# Altium schematic sheet Analog.SchDoc: Analog Input Filter and Protection
size Letter; Revision: 1.0; SheetNumber: 5; PageSetup: Record=PageOptions|CenterHorizontal=True|CenterVertical=True|PrintScale=1.00|XCorrection=1.00|YCorrection=1.00|PrintKind=1|BorderSize=5000000|LeftOffset=0|BottomOffset=0|Orientation=2|PaperLength=1000|PaperWidth=1000|Scale=100|PaperSource=7|PrintQuality=-3|MediaType=1|DitherType=10|PrintScaleMode=1|PaperKind=Letter|PaperIndex=1; ProjectTitle: Data Acquisition System
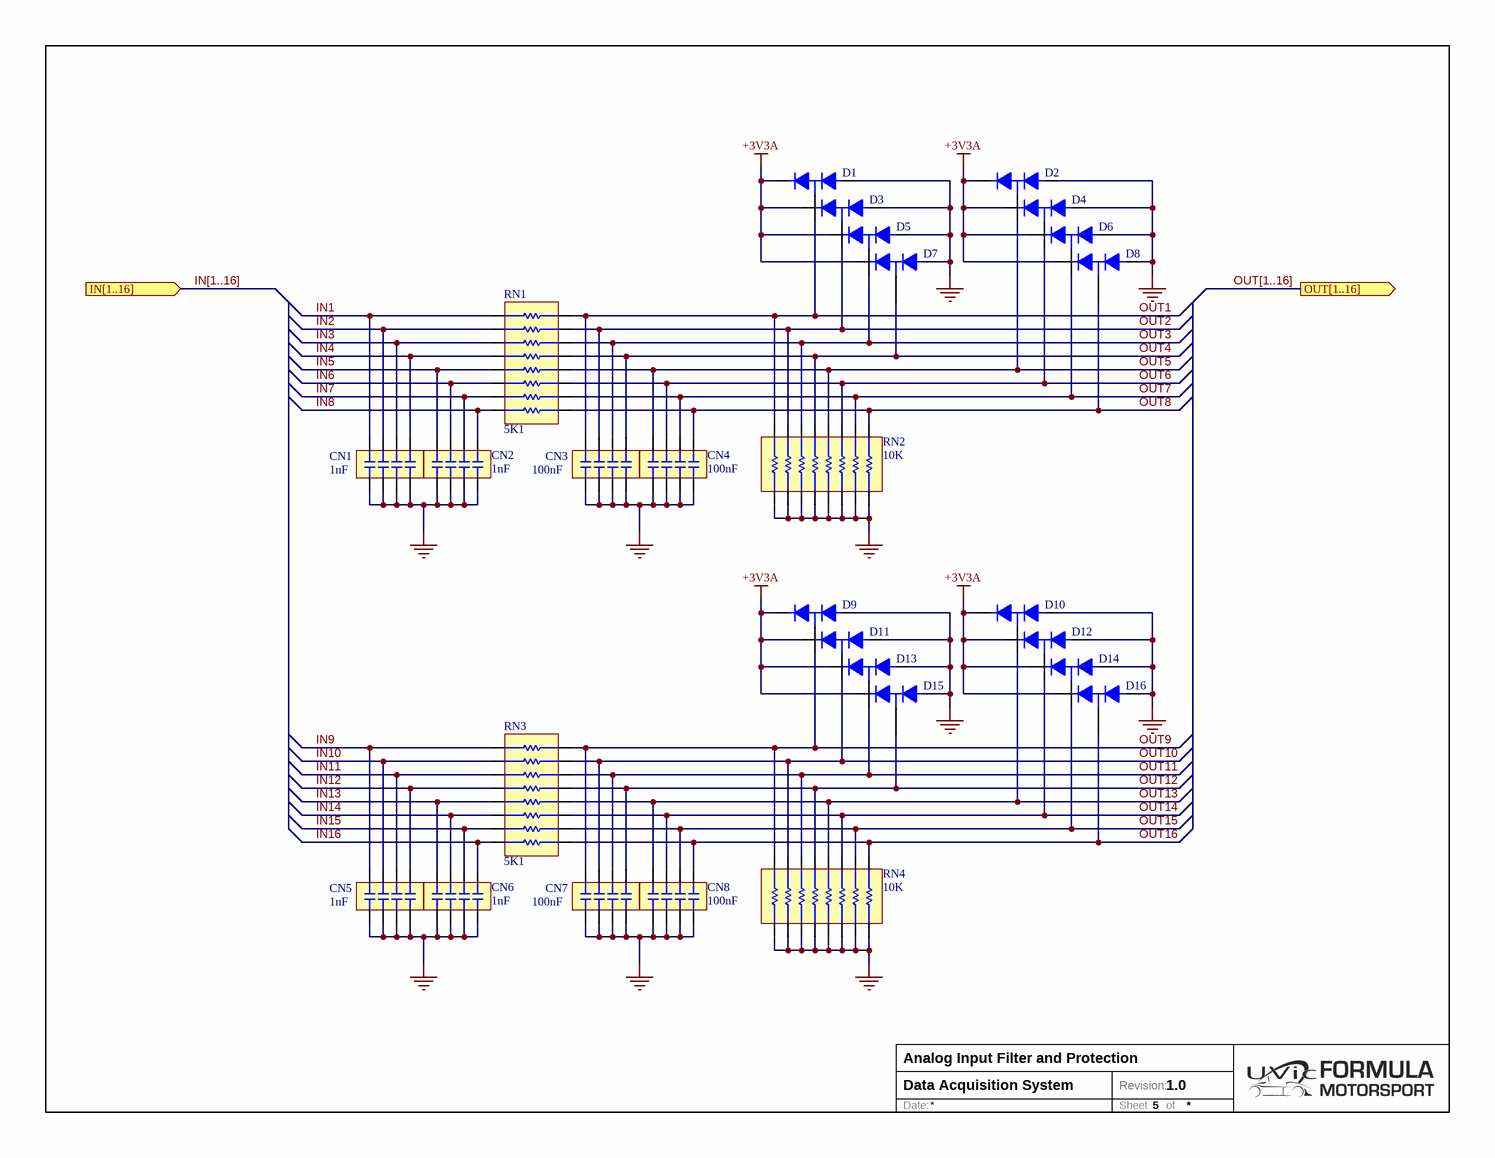
[diagram p0: Analog.SchDoc]

## Parts
CN1  value 1nF  [CAF-80P319X159-8N]  (hidden comment: CKCA43X7R1H102M100AA)
CN2  value 1nF  [CAF-80P319X159-8N]  (hidden comment: CKCA43X7R1H102M100AA)
CN3  value 100nF  [CAF-80P319X159-8N]  (hidden comment: CKCA43X7R1C104M100AA)
CN4  value 100nF  [CAF-80P319X159-8N]  (hidden comment: CKCA43X7R1C104M100AA)
CN5  value 1nF  [CAF-80P319X159-8N]  (hidden comment: CKCA43X7R1H102M100AA)
CN6  value 1nF  [CAF-80P319X159-8N]  (hidden comment: CKCA43X7R1H102M100AA)
CN7  value 100nF  [CAF-80P319X159-8N]  (hidden comment: CKCA43X7R1C104M100AA)
CN8  value 100nF  [CAF-80P319X159-8N]  (hidden comment: CKCA43X7R1C104M100AA)
D1  BAS70-04LT1G  [ONSC-SOT-23-3-318-08_V]  (value not drawn)
D2  BAS70-04LT1G  [ONSC-SOT-23-3-318-08_V]  (value not drawn)
D3  BAS70-04LT1G  [ONSC-SOT-23-3-318-08_V]  (value not drawn)
D4  BAS70-04LT1G  [ONSC-SOT-23-3-318-08_V]  (value not drawn)
D5  BAS70-04LT1G  [ONSC-SOT-23-3-318-08_V]  (value not drawn)
D6  BAS70-04LT1G  [ONSC-SOT-23-3-318-08_V]  (value not drawn)
D7  BAS70-04LT1G  [ONSC-SOT-23-3-318-08_V]  (value not drawn)
D8  BAS70-04LT1G  [ONSC-SOT-23-3-318-08_V]  (value not drawn)
D9  BAS70-04LT1G  [ONSC-SOT-23-3-318-08_V]  (value not drawn)
D10  BAS70-04LT1G  [ONSC-SOT-23-3-318-08_V]  (value not drawn)
D11  BAS70-04LT1G  [ONSC-SOT-23-3-318-08_V]  (value not drawn)
D12  BAS70-04LT1G  [ONSC-SOT-23-3-318-08_V]  (value not drawn)
D13  BAS70-04LT1G  [ONSC-SOT-23-3-318-08_V]  (value not drawn)
D14  BAS70-04LT1G  [ONSC-SOT-23-3-318-08_V]  (value not drawn)
D15  BAS70-04LT1G  [ONSC-SOT-23-3-318-08_V]  (value not drawn)
D16  BAS70-04LT1G  [ONSC-SOT-23-3-318-08_V]  (value not drawn)
RN1  value 5K1  [CAF-80P160X100-8N]  (hidden comment: MNR18ERAPJ512)
RN2  value 10K  [CAF-80P160X100-8N]  (hidden comment: MNR18ERAPJ103)
RN3  value 5K1  [CAF-80P160X100-8N]  (hidden comment: MNR18ERAPJ512)
RN4  value 10K  [CAF-80P160X100-8N]  (hidden comment: MNR18ERAPJ103)

## Ports
IN[1..16] (in), OUT[1..16] (out)

## Nets
+3V3A: D1.2(K) D2.2(K) D3.2(K) D4.2(K) D5.2(K) D6.2(K) D7.2(K) D8.2(K) D9.2(K) D10.2(K) D11.2(K) D12.2(K) D13.2(K) D14.2(K) D15.2(K) D16.2(K)
GND: CN1.1 CN1.2 CN1.3 CN1.4 CN2.1 CN2.2 CN2.3 CN2.4 CN3.1 CN3.2 CN3.3 CN3.4 CN4.1 CN4.2 CN4.3 CN4.4 CN5.1 CN5.2 CN5.3 CN5.4 CN6.1 CN6.2 CN6.3 CN6.4 CN7.1 CN7.2 CN7.3 CN7.4 CN8.1 CN8.2 CN8.3 CN8.4 D1.1(A) D2.1(A) D3.1(A) D4.1(A) D5.1(A) D6.1(A) D7.1(A) D8.1(A) D9.1(A) D10.1(A) D11.1(A) D12.1(A) D13.1(A) D14.1(A) D15.1(A) D16.1(A) RN2.9 RN2.10 RN2.11 RN2.12 RN2.13 RN2.14 RN2.15 RN2.16 RN4.9 RN4.10 RN4.11 RN4.12 RN4.13 RN4.14 RN4.15 RN4.16
IN1: CN1.8 RN1.9
IN2: CN1.7 RN1.10
IN3: CN1.6 RN1.11
IN4: CN1.5 RN1.12
IN5: CN2.8 RN1.13
IN6: CN2.7 RN1.14
IN7: CN2.6 RN1.15
IN8: CN2.5 RN1.16
IN9: CN5.8 RN3.9
IN10: CN5.7 RN3.10
IN11: CN5.6 RN3.11
IN12: CN5.5 RN3.12
IN13: CN6.8 RN3.13
IN14: CN6.7 RN3.14
IN15: CN6.6 RN3.15
IN16: CN6.5 RN3.16
OUT1: CN3.8 D1.3(K/A) RN1.8 RN2.8
OUT2: CN3.7 D3.3(K/A) RN1.7 RN2.7
OUT3: CN3.6 D5.3(K/A) RN1.6 RN2.6
OUT4: CN3.5 D7.3(K/A) RN1.5 RN2.5
OUT5: CN4.8 D2.3(K/A) RN1.4 RN2.4
OUT6: CN4.7 D4.3(K/A) RN1.3 RN2.3
OUT7: CN4.6 D6.3(K/A) RN1.2 RN2.2
OUT8: CN4.5 D8.3(K/A) RN1.1 RN2.1
OUT9: CN7.8 D9.3(K/A) RN3.8 RN4.8
OUT10: CN7.7 D11.3(K/A) RN3.7 RN4.7
OUT11: CN7.6 D13.3(K/A) RN3.6 RN4.6
OUT12: CN7.5 D15.3(K/A) RN3.5 RN4.5
OUT13: CN8.8 D10.3(K/A) RN3.4 RN4.4
OUT14: CN8.7 D12.3(K/A) RN3.3 RN4.3
OUT15: CN8.6 D14.3(K/A) RN3.2 RN4.2
OUT16: CN8.5 D16.3(K/A) RN3.1 RN4.1

## Buses and harness runs
bus IN[1..16] = port IN[1..16]
bus OUT[1..16] = port OUT[1..16]

## Notes on the sheet
- Date:
- Revision:
- Sheet
- of

## Library data of the parts
CN1 CN2 CN5 CN6 = CKCA43X7R1H102M100AA: Capacitor Array - 1nF - 4x - Isolated; Voltage: 16V; Supplier 1: Digi-Key; Supplier Part Number 1: 445-1851-1-ND
CN3 CN4 CN7 CN8 = CKCA43X7R1C104M100AA: Capacitor Array - 100nF - 4x - Isolated; Voltage: 16V; Supplier 1: Digi-Key; Supplier Part Number 1: 445-1857-1-ND
D1-D16 = BAS70-04LT1G: Schottky Diode Array; Supplier 1: Digi-Key; Supplier Part Number 1: BAS70-04LT1GOSCT-ND
RN1 RN3 = MNR18ERAPJ512: Resistor Array - 5K1 - x8 - Independent; Tolerance: 5%; Supplier 1: Digi-Key; Supplier Part Number 1: RHM1559CT-ND
RN2 RN4 = MNR18ERAPJ103: Resistor Array - 10K - x8 - Independent; Tolerance: 5%; Supplier 1: Digi-Key; Supplier Part Number 1: RHM1621CT-ND